# Altium project PCB_Project.PrjPcb (part 1 of 2)
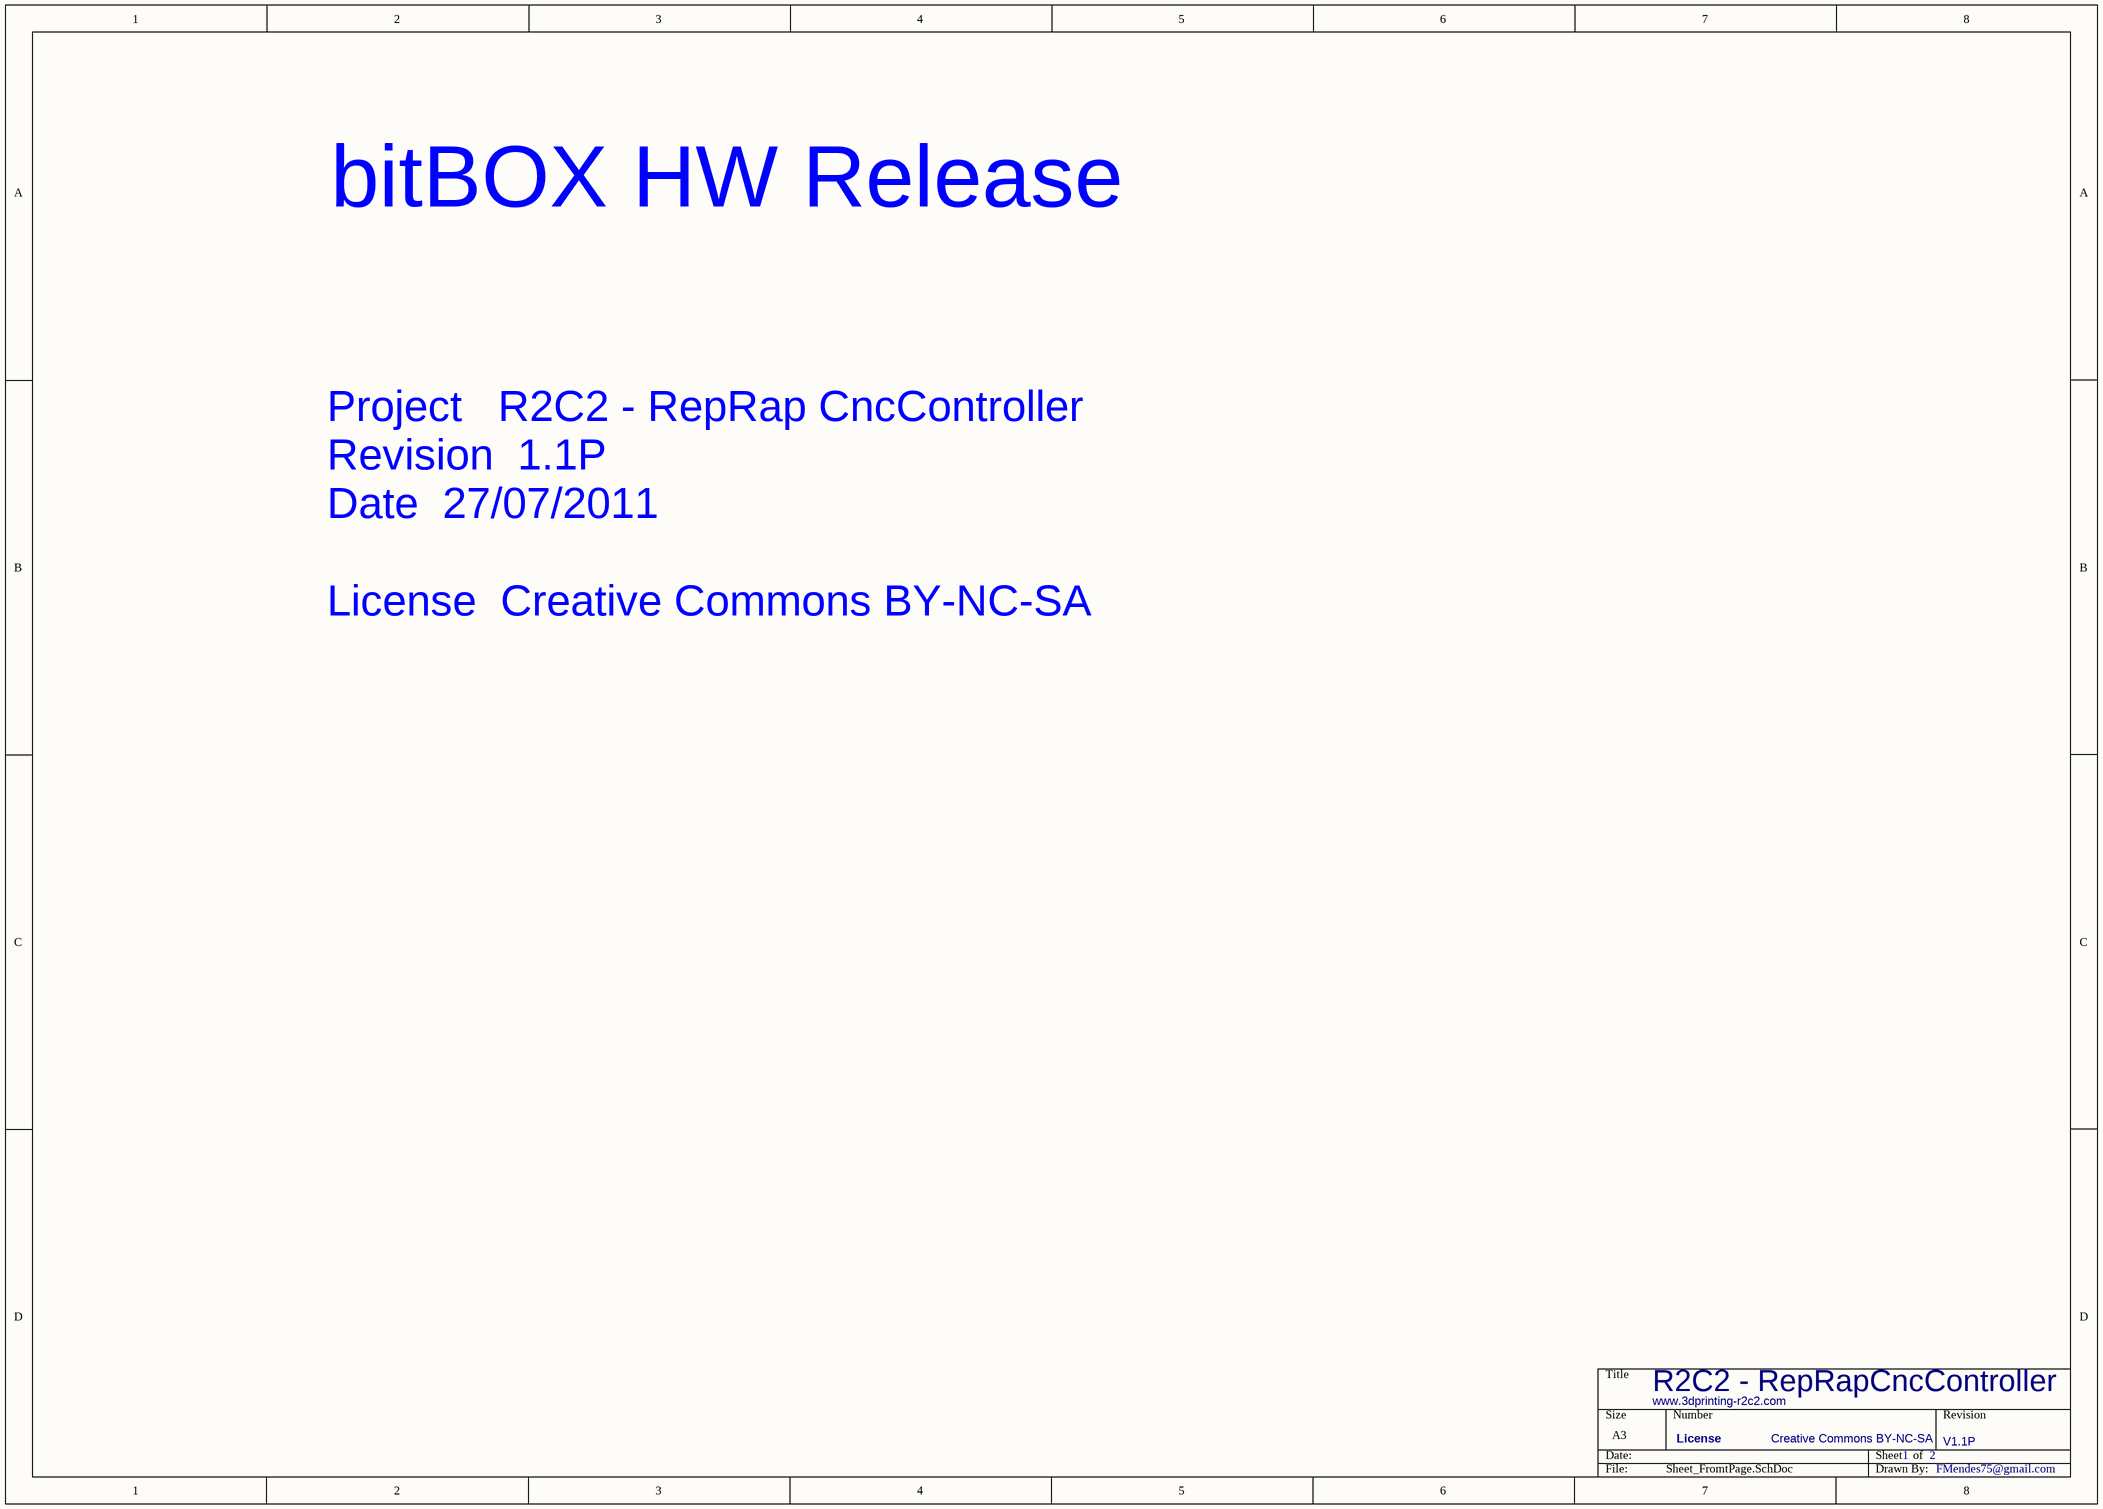
[diagram p0: Sheet_FromtPage.SchDoc]
3 sheets, 284 parts. Net scope: flat (ports and power ports of the same name join across sheets).
Board files: PCB7_optoswitch.PcbDoc, PCB7_main_board.PcbDoc
Sheets:
  Sheet_FromtPage.SchDoc
  Sheet_1.SchDoc
  Sheet_2.SchDoc

## Sheet Sheet_FromtPage.SchDoc: R2C2 - RepRapCncController
size A3; CompanyName: bitBOX; DrawnBy: FMendes75@gmail.com; Revision: V1.1P; SheetNumber: 1; SheetTotal: 2; PageSetup: Record=PageOptions|CenterHorizontal=True|CenterVertical=True|PrintScale=1.04|XCorrection=1.00|YCorrection=1.00|PrintKind=1|BorderSize=5000000|LeftOffset=0|BottomOffset=0|Orientation=2|PaperLength=1000|PaperWidth=1000|Scale=100|PaperSource=7|PrintQuality=-4|MediaType=1|DitherType=10|PaperKind=A3|PrintScaleMode=1; license: Creative Commons BY-NC-SA; Site: www.3dprinting-r2c2.com; ProjectName: R2C2 - RepRapCncController

### Notes on the sheet
- bitBOX HW Release
- Project 		R2C2 - RepRap CncController
  Revision		1.1P
  Date		27/07/2011
  License		Creative Commons BY-NC-SA
- License

## Sheet Sheet_1.SchDoc: R2C2 - RepRapCncController
size A3; CompanyName: bitBOX; DrawnBy: FMendes75@gmail.com; Revision: V1.1P; SheetNumber: 1; SheetTotal: 2; PageSetup: Record=PageOptions|CenterHorizontal=True|CenterVertical=True|PrintScale=1.04|XCorrection=1.00|YCorrection=1.00|PrintKind=1|BorderSize=5000000|LeftOffset=0|BottomOffset=0|Orientation=2|PaperLength=1000|PaperWidth=1000|Scale=100|PaperSource=7|PrintQuality=-4|MediaType=1|DitherType=10|PaperKind=A3|PrintScaleMode=1; license: Creative Commons BY-NC-SA; Site: www.3dprinting-r2c2.com; ProjectName: R2C2 - RepRapCncController
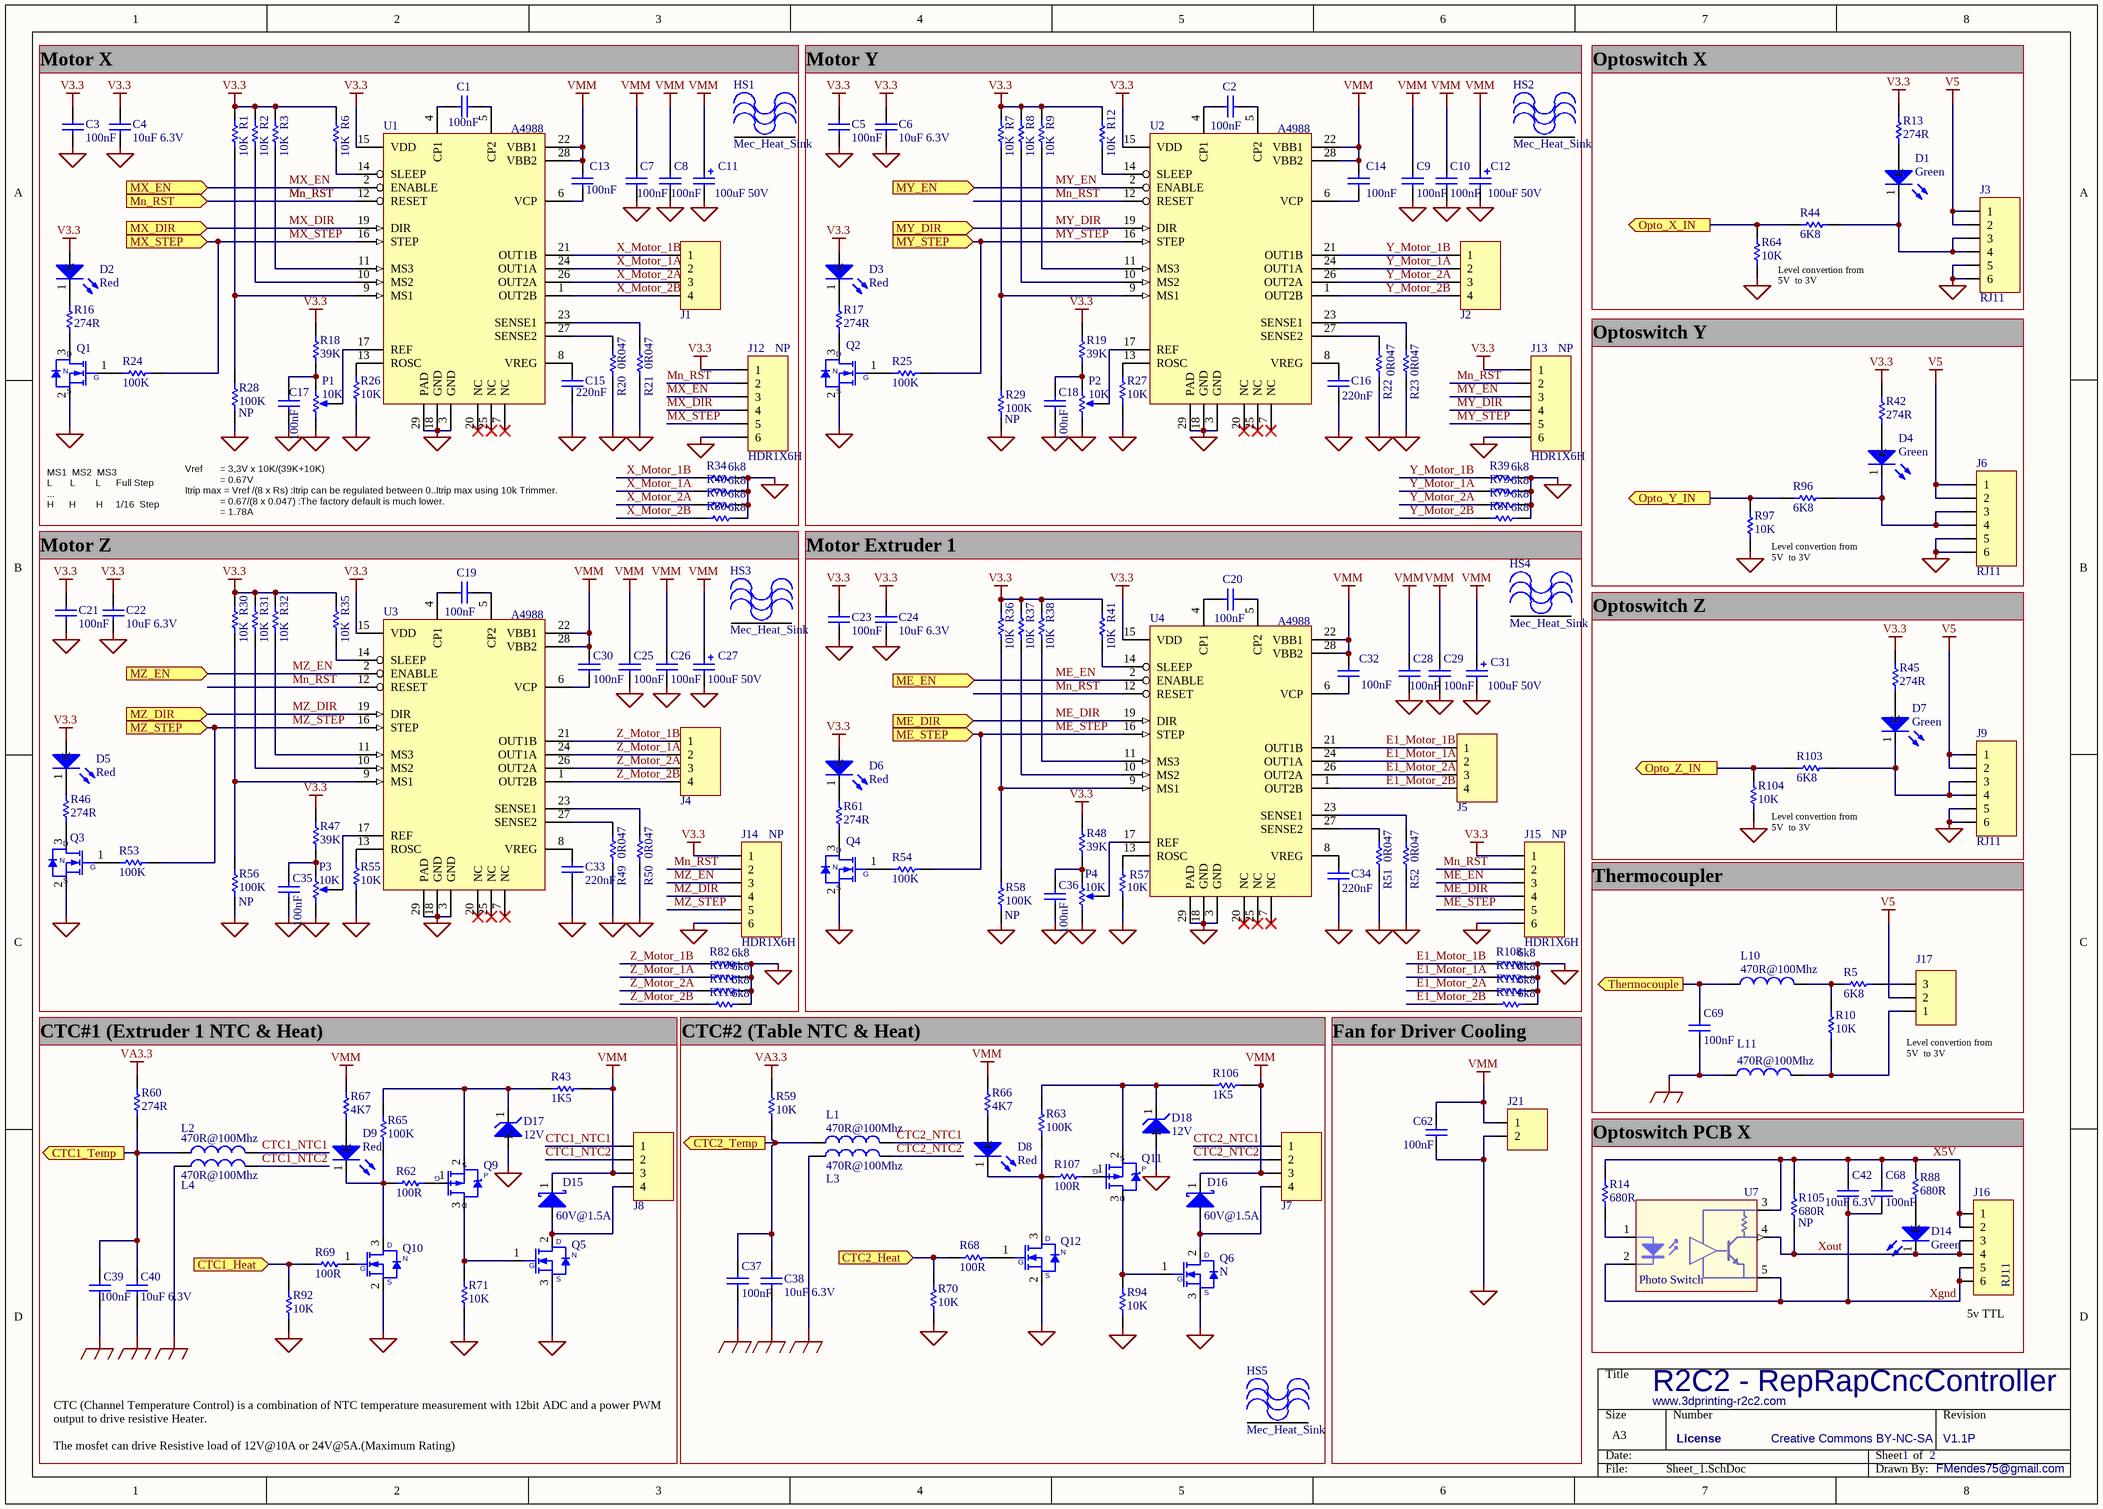
[diagram p1: Sheet_1.SchDoc]

### Parts
C1  100nF  [CAPC1608M]
C2  100nF  [CAPC1608M]
C3  100nF  [CAPC1608M]
C4  10uF 6.3V  [CAPC2012M]
C5  100nF  [CAPC1608M]
C6  10uF 6.3V  [CAPC2012M]
C7  100nF  [CAPC1608M]
C8  100nF  [CAPC1608M]
C9  100nF  [CAPC1608M]
C10  100nF  [CAPC1608M]
C11  100uF 50V  [CAPAE100X100M]
C12  100uF 50V  [CAPAE100X100M]
C13  100nF  [CAPC1608M]
C14  100nF  [CAPC1608M]
C15  220nF  [CAPC1608M]
C16  220nF  [CAPC1608M]
C17  100nF  [CAPC1608M]
C18  100nF  [CAPC1608M]
C19  100nF  [CAPC1608M]
C20  100nF  [CAPC1608M]
C21  100nF  [CAPC1608M]
C22  10uF 6.3V  [CAPC2012M]
C23  100nF  [CAPC1608M]
C24  10uF 6.3V  [CAPC2012M]
C25  100nF  [CAPC1608M]
C26  100nF  [CAPC1608M]
C27  100uF 50V  [CAPAE100X100M]
C28  100nF  [CAPC1608M]
C29  100nF  [CAPC1608M]
C30  100nF  [CAPC1608M]
C31  100uF 50V  [CAPAE100X100M]
C32  100nF  [CAPC1608M]
C33  220nF  [CAPC1608M]
C34  220nF  [CAPC1608M]
C35  100nF  [CAPC1608M]
C36  100nF  [CAPC1608M]
C37  100nF  [CAPC1608M]
C38  10uF 6.3V  [CAPC2012M]
C39  100nF  [CAPC1608M]
C40  10uF 6.3V  [CAPC2012M]
C42  10uF 6.3V  [CAPC2012M]
C62  100nF  [CAPC1608M]
C68  100nF  [CAPC1608M]
C69  100nF  [CAPC1608M]
D1  Green  [LEDM_3216X12M]
D2  Red  [LEDM_3216X12M]
D3  Red  [LEDM_3216X12M]
D4  Green  [LEDM_3216X12M]
D5  Red  [LEDM_3216X12M]
D6  Red  [LEDM_3216X12M]
D7  Green  [LEDM_3216X12M]
D8  Red  [LEDM_3216X12M]
D9  Red  [LEDM_3216X12M]
D14  Green  [LEDM_3216X12M]
D15  60V@1.5A  [SMA]
D16  60V@1.5A  [SMA]
D17  12V  [SOD323]
D18  12V  [SOD323]
HS1  Mec_Heat_Sink  [HS_180x130x50]
HS2  Mec_Heat_Sink  [HS_180x130x50]
HS3  Mec_Heat_Sink  [HS_180x130x50]
HS4  Mec_Heat_Sink  [HS_180x130x50]
HS5  Mec_Heat_Sink  [FK_244_13_D2PAK]
J1  Con 4  [WEIDMULLER_SL-5.08-04-90B]  (value not drawn)
J2  Con 4  [WEIDMULLER_SL-5.08-04-90B]  (value not drawn)
J3  RJ11  [MOLEX_95022-2667]
J4  Con 4  [WEIDMULLER_SL-5.08-04-90B]  (value not drawn)
J5  Con 4  [WEIDMULLER_SL-5.08-04-90B]  (value not drawn)
J6  RJ11  [MOLEX_95022-2667]
J7  Con 4  [WEIDMULLER_SL-5.08-04-90B]  (value not drawn)
J8  Con 4  [WEIDMULLER_SL-5.08-04-90B]  (value not drawn)
J9  RJ11  [MOLEX_95022-2667]
J12  HDR1X6H  Populate: NP  [HDR1X6]
J13  HDR1X6H  Populate: NP  [HDR1X6]
J14  HDR1X6H  Populate: NP  [HDR1X6]
J15  HDR1X6H  Populate: NP  [HDR1X6]
J16  RJ11  [MOLEX_95022-2667]
J17  Con 3  [phoenix-contact_smkdsn-5.08]  (value not drawn)
J21  Con 2  [MOLEX_22-29-2021]  (value not drawn)
L1  470R@100Mhz  [INDC1608M]
L2  470R@100Mhz  [INDC1608M]
L3  470R@100Mhz  [INDC1608M]
L4  470R@100Mhz  [INDC1608M]
L10  470R@100Mhz  [INDC1608M]
L11  470R@100Mhz  [INDC1608M]
P1  10K  [Trimmer_14]
P2  10K  [Trimmer_14]
P3  10K  [Trimmer_14]
P4  10K  [Trimmer_14]
Q1  N  [SOT323-3AM]
Q2  N  [SOT323-3AM]
Q3  N  [SOT323-3AM]
Q4  N  [SOT323-3AM]
Q5  N  [D2PAK]
Q6  N  [D2PAK]
Q9  P  [SOT23-3M]
Q10  N  [SOT323-3AM]
Q11  P  [SOT23-3M]
Q12  N  [SOT323-3AM]
R1  10K  [RESC1608M]
R2  10K  [RESC1608M]
R3  10K  [RESC1608M]
R5  6K8  [RESC1608M]
R6  10K  [RESC1608M]
R7  10K  [RESC1608M]
R8  10K  [RESC1608M]
R9  10K  [RESC1608M]
R10  10K  [RESC1608M]
R12  10K  [RESC1608M]
R13  274R  [RESC1608M]
R14  680R  [RESC1608M]
R16  274R  [RESC1608M]
R17  274R  [RESC1608M]
R18  39K  [RESC1608M]
R19  39K  [RESC1608M]
R20  0R047  [RESC3216M]
R21  0R047  [RESC3216M]
R22  0R047  [RESC3216M]
R23  0R047  [RESC3216M]
R24  100K  [RESC1608M]
R25  100K  [RESC1608M]
R26  10K  [RESC1608M]
R27  10K  [RESC1608M]
R28  100K  Populate: NP  [RESC1608M]
R29  100K  Populate: NP  [RESC1608M]
R30  10K  [RESC1608M]
R31  10K  [RESC1608M]
R32  10K  [RESC1608M]
R34  6k8  [RESC2012L]
R35  10K  [RESC1608M]
R36  10K  [RESC1608M]
R37  10K  [RESC1608M]
R38  10K  [RESC1608M]
R39  6k8  [RESC2012L]
R40  6k8  [RESC2012L]
R41  10K  [RESC1608M]
R42  274R  [RESC1608M]
R43  1K5  [RESC1608M]
R44  6K8  [RESC1608M]
R45  274R  [RESC1608M]
R46  274R  [RESC1608M]
R47  39K  [RESC1608M]
R48  39K  [RESC1608M]
R49  0R047  [RESC3216M]
R50  0R047  [RESC3216M]
R51  0R047  [RESC3216M]
R52  0R047  [RESC3216M]
R53  100K  [RESC1608M]
R54  100K  [RESC1608M]
R55  10K  [RESC1608M]
R56  100K  Populate: NP  [RESC1608M]
R57  10K  [RESC1608M]
R58  100K  Populate: NP  [RESC1608M]
R59  10K  [RESC1608M]
R60  274R  [RESC1608M]
R61  274R  [RESC1608M]
R62  100R  [RESC1608M]
R63  100K  [RESC1608M]
R64  10K  [RESC1608M]
R65  100K  [RESC1608M]
R66  4K7  [RESC1608M]
R67  4K7  [RESC1608M]
R68  100R  [RESC1608M]
R69  100R  [RESC1608M]
R70  10K  [RESC1608M]
R71  10K  [RESC1608M]
R73  6k8  [RESC2012L]
R78  6k8  [RESC2012L]
R79  6k8  [RESC2012L]
R80  6k8  [RESC2012L]
R81  6k8  [RESC2012L]
R82  6k8  [RESC2012L]
R88  680R  [RESC1608M]
R92  10K  [RESC1608M]
R94  10K  [RESC1608M]
R96  6K8  [RESC1608M]
R97  10K  [RESC1608M]
R103  6K8  [RESC1608M]
R104  10K  [RESC1608M]
R105  680R  Populate: NP  [RESC1608M]
R106  1K5  [RESC1608M]
R107  100R  [RESC1608M]
R108  6k8  [RESC2012L]
R109  6k8  [RESC2012L]
R110  6k8  [RESC2012L]
R111  6k8  [RESC2012L]
R112  6k8  [RESC2012L]
R113  6k8  [RESC2012L]
R114  6k8  [RESC2012L]
U1  A4988  [QFN50P500X500X100-28M]
U2  A4988  [QFN50P500X500X100-28M]
U3  A4988  [QFN50P500X500X100-28M]
U4  A4988  [QFN50P500X500X100-28M]
U7  Photo Switch  [OPIC_122x50x10]

### Ports
CTC1_Heat (in), CTC1_Temp (out), CTC2_Heat (in), CTC2_Temp (out), ME_DIR (in), ME_EN (in), ME_STEP (in), Mn_RST (in), MX_DIR (in), MX_EN (in), MX_STEP (in), MY_DIR (in), MY_EN (in), MY_STEP (in), MZ_DIR (in), MZ_EN (in), MZ_STEP (in), Opto_X_IN (out), Opto_Y_IN (out), Opto_Z_IN (out), Thermocouple (out)

### Nets
GND: C3.1 C4.1 C5.1 C6.1 C7.2 C8.1 C9.1 C10.1 C11.2 C12.2 C15.1 C16.1 C17.1 C18.2 C21.1 C22.1 C23.1 C24.1 C25.1 C26.1 C27.2 C28.1 C29.1 C31.2 C33.1 C34.1 C35.1 C36.1 C62.1 D17.2(A) D18.2(A) J3.5 J3.6 J6.5 J6.6 J9.5 J9.6 J12.6 J13.6 J14.6 J15.6 J21.2 P1.1(TOP) P2.1(TOP) P3.1(TOP) P4.1(TOP) Q1.2(S) Q2.2(S) Q3.2(S) Q4.2(S) Q5.3(S) Q6.3(S) Q10.2(S) Q12.2(S) R20.1 R21.1 R22.1 R23.1 R26.1 R27.1 R28.1 R29.1 R34.2 R39.2 R40.2 R49.1 R50.1 R51.1 R52.1 R55.1 R56.1 R57.1 R58.1 R64.1 R70.1 R71.1 R73.2 R78.2 R79.2 R80.2 R81.2 R82.2 R92.1 R94.1 R97.1 R104.1 R108.2 R109.2 R110.2 R111.2 R112.2 R113.2 R114.2 U1.3(GND) U1.18(GND) U1.29(PAD) U2.3(GND) U2.18(GND) U2.29(PAD) U3.3(GND) U3.18(GND) U3.29(PAD) U4.3(GND) U4.18(GND) U4.29(PAD)
GND_A: C37.1 C38.1 C39.1 C40.1 C69.1 L3.1 L4.1 L11.1
V3.3: C3.2 C4.2 C5.2 C6.2 C21.2 C22.2 C23.2 C24.2 D2.2(A) D3.2(A) D5.2(A) D6.2(A) J12.1 J13.1 J14.1 J15.1 R1.2 R2.2 R3.2 R6.2 R7.2 R8.2 R9.2 R12.2 R13.2 R18.2 R19.2 R30.2 R31.2 R32.2 R35.2 R36.2 R37.2 R38.2 R41.2 R42.2 R45.2 R47.2 R48.2 U1.15(VDD) U2.15(VDD) U3.15(VDD) U4.15(VDD)
V5: J3.1 J3.2 J6.1 J6.2 J9.1 J9.2 J17.2
VA3.3: R59.2 R60.2
VMM: C7.1 C8.2 C9.2 C10.2 C11.1 C12.1 C13.2 C14.2 C25.2 C26.2 C27.1 C28.2 C29.2 C30.2 C31.1 C32.2 C62.2 D15.1(K) D16.1(K) J7.3 J8.3 J21.1 R43.2 R66.2 R67.2 R106.2 U1.22(VBB1) U1.28(VBB2) U2.22(VBB1) U2.28(VBB2) U3.22(VBB1) U3.28(VBB2) U4.22(VBB1) U4.28(VBB2)
CTC1_NTC1: J8.1 L2.2
CTC1_NTC2: J8.2 L4.2
CTC2_NTC1: J7.1 L1.2
CTC2_NTC2: J7.2 L3.2
E1_Motor_1A: J5.2 R110.1 U4.24(OUT1A)
E1_Motor_1B: J5.1 R108.1 U4.21(OUT1B)
E1_Motor_2A: J5.3 R112.1 U4.26(OUT2A)
E1_Motor_2B: J5.4 R114.1 U4.1(OUT2B)
EXP_AD2_P0.25: C69.2 L10.1 ; port Thermocouple
ME_DIR: J15.4 U4.19(DIR) ; port ME_DIR
ME_EN: J15.3 U4.2(ENABLE) ; port ME_EN
ME_STEP: J15.5 R54.2 U4.16(STEP) ; port ME_STEP
Mn_RST: J12.2 J13.2 J14.2 J15.2 U1.12(RESET) U2.12(RESET) U3.12(RESET) U4.12(RESET) ; port Mn_RST
MX_DIR: J12.4 U1.19(DIR) ; port MX_DIR
MX_EN: J12.3 U1.2(ENABLE) ; port MX_EN
MX_STEP: J12.5 R24.2 U1.16(STEP) ; port MX_STEP
MY_DIR: J13.4 U2.19(DIR) ; port MY_DIR
MY_EN: J13.3 U2.2(ENABLE) ; port MY_EN
MY_STEP: J13.5 R25.2 U2.16(STEP) ; port MY_STEP
MZ_DIR: J14.4 U3.19(DIR) ; port MZ_DIR
MZ_EN: J14.3 U3.2(ENABLE) ; port MZ_EN
MZ_STEP: J14.5 R53.2 U3.16(STEP) ; port MZ_STEP
X5V: C42.2 C68.2 J16.1 J16.2 R14.2 R88.2 R105.2 U7.3(Vcc)
X_Motor_1A: J1.2 R40.1 U1.24(OUT1A)
X_Motor_1B: J1.1 R34.1 U1.21(OUT1B)
X_Motor_2A: J1.3 R78.1 U1.26(OUT2A)
X_Motor_2B: J1.4 R80.1 U1.1(OUT2B)
Xgnd: C42.1 C68.1 J16.5 J16.6 U7.2(K) U7.5(GND)
Xout: D14.1(K) J16.3 J16.4 R105.1 U7.4(Out)
Y_Motor_1A: J2.2 R73.1 U2.24(OUT1A)
Y_Motor_1B: J2.1 R39.1 U2.21(OUT1B)
Y_Motor_2A: J2.3 R79.1 U2.26(OUT2A)
Y_Motor_2B: J2.4 R81.1 U2.1(OUT2B)
Z_Motor_1A: J4.2 R109.1 U3.24(OUT1A)
Z_Motor_1B: J4.1 R82.1 U3.21(OUT1B)
Z_Motor_2A: J4.3 R111.1 U3.26(OUT2A)
Z_Motor_2B: J4.4 R113.1 U3.1(OUT2B)
NetC1_1: C1.1 U1.5(CP2)
NetC1_2: C1.2 U1.4(CP1)
NetC2_1: C2.1 U2.4(CP1)
NetC2_2: C2.2 U2.5(CP2)
NetC13_1: C13.1 U1.6(VCP)
NetC14_1: C14.1 U2.6(VCP)
NetC15_2: C15.2 U1.8(VREG)
NetC16_2: C16.2 U2.8(VREG)
NetC17_2: C17.2 P1.2(BOT) R18.1
NetC18_1: C18.1 P2.2(BOT) R19.1
NetC19_1: C19.1 U3.5(CP2)
NetC19_2: C19.2 U3.4(CP1)
NetC20_1: C20.1 U4.4(CP1)
NetC20_2: C20.2 U4.5(CP2)
NetC30_1: C30.1 U3.6(VCP)
NetC32_1: C32.1 U4.6(VCP)
NetC33_2: C33.2 U3.8(VREG)
NetC34_2: C34.2 U4.8(VREG)
NetC35_2: C35.2 P3.2(BOT) R47.1
NetC36_2: C36.2 P4.2(BOT) R48.1
NetC37_2: C37.2 C38.2 L1.1 R59.1 ; port CTC2_Temp
NetC39_2: C39.2 C40.2 L2.1 R60.1 ; port CTC1_Temp
NetD1_1: D1.1(K) J3.3 J3.4 R44.1
NetD1_2: D1.2(A) R13.1
NetD2_1: D2.1(K) R16.2
NetD3_1: D3.1(K) R17.2
NetD4_1: D4.1(K) J6.3 J6.4 R96.1
NetD4_2: D4.2(A) R42.1
NetD5_1: D5.1(K) R46.2
NetD6_1: D6.1(K) R61.2
NetD7_1: D7.1(K) J9.3 J9.4 R103.1
NetD7_2: D7.2(A) R45.1
NetD8_1: D8.1(K) Q12.3(D) R63.1 R107.1
NetD8_2: D8.2(A) R66.1
NetD9_1: D9.1(K) Q10.3(D) R62.1 R65.1
NetD9_2: D9.2(A) R67.1
NetD14_2: D14.2(A) R88.1
NetD15_2: D15.2(A) J8.4 Q5.2(D)
NetD16_2: D16.2(A) J7.4 Q6.2(D)
NetD17_1: D17.1(K) Q9.2(S) R43.1 R65.2
NetD18_1: D18.1(K) Q11.2(S) R63.2 R106.1
NetJ17_1: J17.1 L11.2 R10.2
NetJ17_3: J17.3 R5.2
NetL10_2: L10.2 R5.1 R10.1
NetP1_3: P1.3(TAP) U1.17(REF)
NetP2_3: P2.3(TAP) U2.17(REF)
NetP3_3: P3.3(TAP) U3.17(REF)
NetP4_3: P4.3(TAP) U4.17(REF)
NetQ1_1: Q1.1(G) R24.1
NetQ1_3: Q1.3(D) R16.1
NetQ2_1: Q2.1(G) R25.1
NetQ2_3: Q2.3(D) R17.1
NetQ3_1: Q3.1(G) R53.1
NetQ3_3: Q3.3(D) R46.1
NetQ4_1: Q4.1(G) R54.1
NetQ4_3: Q4.3(D) R61.1
NetQ5_1: Q5.1(G) Q9.3(D) R71.2
NetQ6_1: Q6.1(G) Q11.3(D) R94.2
NetQ9_1: Q9.1(G) R62.2
NetQ10_1: Q10.1(G) R69.2
NetQ11_1: Q11.1(G) R107.2
NetQ12_1: Q12.1(G) R68.2
NetR1_1: R1.1 R28.2 U1.9(MS1)
NetR2_1: R2.1 U1.10(MS2)
NetR3_1: R3.1 U1.11(MS3)
NetR6_1: R6.1 U1.14(SLEEP)
NetR7_1: R7.1 R29.2 U2.9(MS1)
NetR8_1: R8.1 U2.10(MS2)
NetR9_1: R9.1 U2.11(MS3)
NetR12_1: R12.1 U2.14(SLEEP)
NetR14_1: R14.1 U7.1(A)
NetR20_2: R20.2 U1.27(SENSE2)
NetR21_2: R21.2 U1.23(SENSE1)
NetR22_2: R22.2 U2.27(SENSE2)
NetR23_2: R23.2 U2.23(SENSE1)
NetR26_2: R26.2 U1.13(ROSC)
NetR27_2: R27.2 U2.13(ROSC)
NetR30_1: R30.1 R56.2 U3.9(MS1)
NetR31_1: R31.1 U3.10(MS2)
NetR32_1: R32.1 U3.11(MS3)
NetR35_1: R35.1 U3.14(SLEEP)
NetR36_1: R36.1 R58.2 U4.9(MS1)
NetR37_1: R37.1 U4.10(MS2)
NetR38_1: R38.1 U4.11(MS3)
NetR41_1: R41.1 U4.14(SLEEP)
NetR44_2: R44.2 R64.2 ; port Opto_X_IN
NetR49_2: R49.2 U3.27(SENSE2)
NetR50_2: R50.2 U3.23(SENSE1)
NetR51_2: R51.2 U4.27(SENSE2)
NetR52_2: R52.2 U4.23(SENSE1)
NetR55_2: R55.2 U3.13(ROSC)
NetR57_2: R57.2 U4.13(ROSC)
NetR68_1: R68.1 R70.2 ; port CTC2_Heat
NetR69_1: R69.1 R92.2 ; port CTC1_Heat
NetR96_2: R96.2 R97.2 ; port Opto_Y_IN
NetR103_2: R103.2 R104.2 ; port Opto_Z_IN

Not connected (* = marked no-connect by the designer): U1 7(NC)* 20(NC)* 25(NC)*; U2 7(NC)* 20(NC)* 25(NC)*; U3 7(NC)* 20(NC)* 25(NC)*; U4 7(NC)* 20(NC)* 25(NC)*

### Notes on the sheet
- Motor X
- Motor Y
- Optoswitch X
- (near R64) Level convertion from 5V  to 3V
- Optoswitch Y
- MS1  MS2  MS3
  L       L        L      Full Step
  ...
  H      H        H     1/16  Step
- Vref       = 3,3V x 10K/(39K+10K)
  = 0.67V
  Itrip max = Vref /(8 x Rs)	:Itrip can be regulated between 0..Itrip max using 10k Trimmer.
  = 0.67/(8 x 0.047)	:The factory default is much lower.
  = 1.78A
- (near R80) Motor Z
- Motor Extruder 1
- (near R97) Level convertion from 5V  to 3V
- Optoswitch Z
- (near R104) Level convertion from 5V  to 3V
- Thermocoupler
- CTC#1 (Extruder 1 NTC & Heat)
- (near R113) CTC#2 (Table NTC & Heat)
- (near R114) Fan for Driver Cooling
- (near J17) Level convertion from 5V  to 3V
- Optoswitch PCB X
- (near J16) 5v TTL
- CTC (Channel Temperature Control) is a combination of NTC temperature measurement with 12bit ADC and a power PWM output to drive resistive Heater.
  The mosfet can drive Resistive load of 12V@10A or 24V@5A.(Maximum Rating)
- License

### Library data of the parts
C1 C3 C5 C7-C10 C13 C14 C17-C19 C21 C23 C25 C26 C28-C30 C32 C35-C37 C39 C62 C68 C69 = 10000054: Capacitor - MLCC; 0603; NP0; 50V; Manufacturer: Multicomp; Type: smd; Designator: C; Man PN: MCCA000255; Pack: 0603; Distri Price1: 0,008; Distri Qty1: 100; Part Number: 10000054; Value: 100nF; Pin Count: 2; Distri Link1: http://pt.farnell.com/multicomp/mcca000255/mlcc-0603-x7r-50v-100nf/dp/1759122; Component Type: Standard
C2 C20 = 10000054: Capacitor Non Polarized; Manufacturer: Multicomp; Type: smd; Designator: C; Man PN: MCCA000255; Description: Capacitor - MLCC; 0603; NP0; 50V; Pack: 0603; Distri Price1: 0,008; Distri Qty1: 100; Part Number: 10000054; Component Type: Standard; Value: 100nF; Pin Count: 2; Distri Link1: http://pt.farnell.com/multicomp/mcca000255/mlcc-0603-x7r-50v-100nf/dp/1759122
C4 C6 C22 C24 C38 C40 C42 = 10000001: Capacitor - MLCC; 0805; Y5V; 10UF; 6.3V; Manufacturer: MULTICOMP; Type: smd; Designator: C; Man PN: MCCA000268; Pack: 0805; Distri Price1: 0,039; Distri Qty1: 100; Part Number: 10000001; Verified: 17-01-2011; Value: 10uF 6.3V; Pin Count: 2; Distri Link1: http://pt.farnell.com/multicomp/mcca000268/mlcc-08055v-6-3v-10uf/dp/1759136; Stock: 0; Component Type: Standard
C11 C12 C27 C31 = 10000069: Capacitor - Al. Electrolytic; 100UF; 50V; Manufacturer: Vishay; Type: smd; Designator: C; Man PN: 222215097101; Distri Price1: 0,71; Distri Qty1: 100; Part Number: 10000069; Value: 100uF 50V; Pin Count: 2; Distri Link1: http://pt.farnell.com/vishay-bc-components/222215097101/cap-alum-elect-100uf-50v-smd/dp/1838778; Component Type: Standard
C15 C16 C33 C34 = 10000059: Capacitor - MLCC; 0603; NP0; 50V; Manufacturer: Multicomp; Type: smd; Designator: C; Pack: 0603; Distri Price1: 0,08; Distri Qty1: 100; Distri Price2: 0,018; Part Number: 10000059; Value: 220nF; Pin Count: 2; Distri Link1: http://pt.farnell.com/multicomp/mcca000196/mlcc-0603-np0-50v-22pf/dp/1759057; Distri Link2: http://search.digikey.com/scripts/DkSearch/dksus.dll?Detail&name=709-1156-1-ND; Distri Qty2: 100; Component Type: Standard
D1 D4 D7 D14 = 10000008: Led - 1206; Green OSRAM; Type: smd; Designator: D; Man PN: LGQ971; Pack: 1206; Distri Price1: 0,063; Distri Qty1: 100; Part Number: 10000008; Manufacturer: OSRAM; Value: Green; Pin Count: 2; Distri Link1: http://pt.farnell.com/osram/lgq971/led-smd-green/dp/1226372; Stock: 0; Component Type: Standard
D2 D3 D5 D6 D8 D9 = 10000089: Led - 1206; Red; Type: smd; Designator: D; Pack: 1206; Distri Price1: 0; Distri Qty1: 100; Part Number: 10000089; Man PN: -; Manufacturer: -; Value: Red; Pin Count: 2; Distri Link1: -; Distri Link2: -; Distri Price2: 0; Distri Qty2: 100; Stock: 0; ComponentLink1URL: -; ComponentLink2Description: -; ComponentLink2URL: -; Signal Integrity: -; Simulation: -; Component Type: Standard; Verified: 05-05-2011
D15 D16 = 10000010: Diode - Schottky; 1.5A; 60V; Manufacturer: VISHAY; Type: smd; Designator: D; Man PN: VS-10MQ060NTRPBF; Distri Price1: 0,092; Distri Qty1: 100; Part Number: 10000010; Value: 60V@1.5A; Pack: SMA; Pin Count: 2; Distri Link1: http://pt.farnell.com/vishay-formerly-i-r/vs-10mq060ntrpbf/diode-schottky-1-5a-60v/dp/1463213; Stock: 0; Component Type: Standard
D17 D18 = 10000088: Diode - Zener; 0.4W; 12V; Manufacturer: NXP; Type: smd; Designator: D; Man PN: PDZ12B; Pack: SC-76; Distri Qty1: 100; Part Number: 10000088; Value: 12V; Pin Count: 2; Distri Link1: http://pt.farnell.com/nxp/pdz12b-115/diode-zener-0-4w-12v-sod323/dp/1757850; Component Type: Standard
HS1-HS4 = 10000090: Heat Sink - IC stiker; Designator: HS; Distri Qty1: 0; Part Number: 10000090; Type: smd; Man PN: -; Manufacturer: -; Value: -; Pack: -; Pin Count: 0; Component Type: Standard
HS5 = 10000091: Heat Sink - For D2PAK; Manufacturer: Fischer Elektronik; Designator: HS; Man PN: FK-244-13 D2 PAK; Distri Price1: 0,82; Distri Qty1: 25; Part Number: 10000091; Type: smd; Value: -; Pack: -; Pin Count: 2; Distri Link1: http://pt.farnell.com/fischer-elektronik/fk-244-13-d2-pak/heat-sink-for-d2-pak-22-8-c-w/dp/4302436; Distri Link2: -; Distri Price2: -; Distri Qty2: -; Stock: 0; ComponentLink1Description: -; ComponentLink1URL: -; ComponentLink2Description: -; ComponentLink2URL: -; Signal Integrity: -; Simulation: -; Component Type: Standard; Verified: 09-05-2011
J1 J2 J4 J5 J7 J8 = 10000023: Connector - Header male; Screw; 4way; Hor.; Manufacturer: WEIDMULLER; Designator: J; Man PN: SL 5.08/4/90B; Distri Price1: 0,5; Distri Qty1: 100; Distri Price2: 0,173; Part Number: 10000023; Type: THD; Pin Count: 4; Distri Link1: http://pt.farnell.com/jsp/search/productdetail.jsp?sku=1121838; Distri Link2: http://search.digikey.com/scripts/DkSearch/dksus.dll?Detail&name=ED2830-ND; Distri Qty2: 100; Stock: 0; Component Type: Standard
J3 J6 J9 J16 = 10000062: Connector - PCB; RJ11; 6/4 Low Profile; Hor.; Manufacturer: Molex; Designator: J; Man PN: 95501-2641; Distri Qty1: 100; Distri Price1: 0,51; Distri Price2: 0,479; Part Number: 10000062; Type: THD; Value: RJ11; Pin Count: 6; Distri Link1: http://pt.farnell.com/molex/95501-2641/jack-6-4-low-profile/dp/1560166; Component Type: Standard; Distri Link2: http://search.digikey.com/scripts/DkSearch/dksus.dll?Detail&name=380-1018-ND; Distri Qty2: 100
J12-J15 = 10000093: Designator: J; Description: Connector - Header 1x6; Vert..; Distri Price1: 0; Part Number: 10000093; Component Type: Standard; Type: THD; Man PN: -; Manufacturer: -; Value: HDR1X6H; Pack: -; Pin Count: 6; Distri Link1: -; Distri Qty1: 0; Distri Link2: -; Distri Price2: -; Distri Qty2: -; Stock: 0; ComponentLink1Description: -; ComponentLink1URL: -; ComponentLink2Description: -; ComponentLink2URL: -; Signal Integrity: -; Simulation: -
J17 = 10000095: Manufacturer: Phoenix_Contact; Designator: J; Man PN: SMKDSN1.5/3-5.08; Description: Terminal Block; Distri Price1: 76; Distri Qty1: 100; Part Number: 10000095; Component Type: Standard; Type: smd; Value: -; Pack: -; Pin Count: 3; Distri Link1: http://pt.farnell.com/phoenix-contact/smkdsn1-5-3-5-08/term-blk-pcb-55deg-5-08mm-3way/dp/1792904; Distri Link2: -; Distri Price2: -; Distri Qty2: -; Stock: 0; ComponentLink1Description: -; ComponentLink1URL: -; ComponentLink2Description: -; ComponentLink2URL: -; Signal Integrity: -; Simulation: -; Verified: 17-05-2011
J21 = 10000097: Connector - PCB; Header; SQ Pin, 2 way; 2.54mm; Vert; Manufacturer: Molex; Designator: J; Distri Qty1: 0; Part Number: 10000097; Component Type: Standard; Type: smd; Man PN: 22-29-2021; Value: -; Pack: -; Pin Count: 2; Distri Link1: http://pt.farnell.com/molex/22-29-2021/header-vertical-sq-pin-0-1-2way/dp/1360130; Distri Price2: 0
L1-L4 L10 L11 = 10000032: Ferrite Bead - 470OHM; 0603; Manufacturer: MURATA; Type: smd; Designator: L; Man PN: BLM18PG471SN1D; Pack: 0603; Distri Price1: 0,034; Distri Qty1: 100; Part Number: 10000032; Value: 470R@100Mhz; Pin Count: 2; Stock: 0; Component Type: Standard
P1-P4 = 10000092: Resistor - Trimmer; 1/4"; 10K; Manufacturer: Bourns; Designator: R; Man PN: 3362P-1-103LF; Distri Price1: 0; Part Number: 10000092; Type: THD; Value: 10K; Pack: -; Pin Count: 3; Distri Link1: -; Distri Qty1: 0
Q1-Q4 Q10 Q12 = 10000039: Mosfet - N; 60V; 0.3A;; Manufacturer: NXP; Type: smd; Designator: Q; Man PN: 2N7002PW; Pack: SOT323; Distri Price1: 0,025; Distri Qty1: 100; Part Number: 10000039; Distri Link1: http://pt.farnell.com/nxp/2n7002pw/mosfet-n-ch-60v-0-3a-sot323/dp/1829184; Stock: 0; Component Type: Standard
Q5 Q6 = 10000078: N-channel Enhancement Mode Field-effect Transistor (123/gds); Manufacturer: IR; Type: smd; Designator: Q; Man PN: IRFS3806PbF; Value: 60V; 43A; Description: Mosfet - Power High Efficiency for SMPS; Distri Price1: 0,45; Distri Qty1: 100; Part Number: 10000078; Component Type: Standard; Pack: D2PAK; Pin Count: 3; Distri Link1: http://pt.farnell.com/international-rectifier/irfs3806pbf/mosfet-n-d2-pak/dp/1602233; Distri Link2: -; Distri Price2: -; Distri Qty2: -; Stock: 0; ComponentLink1URL: -; ComponentLink2Description: -; ComponentLink2URL: -; Signal Integrity: -; Simulation: -; Verified: 03-03-2011
Q9 Q11 = 10000076: Mosfet - Power; Vdss=-30v; Rds=0.60; Id=-0.6A; Manufacturer: IR; Type: smd; Designator: Q; Man PN: IRLML5103; Value: 0.6A; Pack: Sot-23; Distri Price1: 0,128; Distri Qty1: 100; Part Number: 10000076; Component Type: Standard; Pin Count: 3; Distri Link1: http://pt.farnell.com/international-rectifier/irlml5103trpbf/mosfet-p-micro3/dp/1463265; Distri Link2: -; Distri Price2: -; Distri Qty2: -; Stock: 0; ComponentLink1URL: -; ComponentLink2Description: -; ComponentLink2URL: -; Signal Integrity: -; Simulation: -
R1-R3 R6-R9 R12 R26 R27 R30-R32 R35-R38 R41 R55 R57 R64 R70 R71 R92 R94 R97 R104 = 10000044: Resistor - 0603; 0.063W; 1%; Manufacturer: Multicomp; Designator: R; Man PN: MC 0.063W 0603 1% 10K; Pack: 0603; Distri Qty1: 0; Part Number: 10000044; Type: smd; Value: 10K; Pin Count: 2; Component Type: Standard
R5 R44 R96 R103 = 10000096: Resistor - 0603; 0.063W; 1%; Designator: R; Distri Qty1: 0; Part Number: 10000096; Component Type: Standard; Type: smd; Man PN: -; Manufacturer: -; Value: 6K8; Pack: -; Pin Count: 2; Distri Link1: -
R10 R59 = 10000044: Resistor; Manufacturer: Multicomp; Designator: R; Man PN: MC 0.063W 0603 1% 10K; Description: Resistor - 0603; 0.063W; 1%; Pack: 0603; Distri Qty1: 0; Part Number: 10000044; Component Type: Standard; Type: smd; Value: 10K; Pin Count: 2
R13 R16 R17 R42 R45 R46 R61 = 10000041: Resistor - 0603; 0.063W; 1%; Manufacturer: Multicomp; Designator: R; Man PN: MC 0.063W 0603 1% 274R; Pack: 0603; Distri Price1: 0,008; Distri Qty1: 250; Part Number: 10000041; Type: smd; Value: 274R; Pin Count: 2; Distri Link1: http://pt.farnell.com/multicomp/mc-0-063w-0603-1-274r/resistor-0603-274r/dp/1170730; Stock: 0; Component Type: Standard
R14 R88 R105 = 10000061: Resistor - 0603; 0.063W; 1%; Manufacturer: Multicomp; Designator: R; Man PN: MC 0.063W 0603 1% 680R; Pack: 0603; Distri Price1: 0,016; Distri Qty1: 100; Distri Price2: 0,006; Part Number: 10000061; Type: smd; Value: 680R; Pin Count: 2; Distri Link1: http://pt.farnell.com/multicomp/mc-0-063w-0603-5-680r/resistor-0603-680r/dp/9332251; Distri Link2: http://pt.farnell.com/multicomp/mc-0-063w-0603-5-680r/resistor-0603-680r/dp/9332251; Distri Qty2: 100; Component Type: Standard
R18 R19 R47 R48 = 10000087: Resistor - 0603; 0.063W; 1%; Designator: R; Pack: 0603; Distri Qty1: 100; Part Number: 10000087; Type: smd; Man PN: -; Manufacturer: -; Value: 39K; Pin Count: 2; Distri Link1: -; Component Type: Standard
R20-R23 R49-R52 = 10000047: Resistor - 1206; 0.5W; 1%; Manufacturer: YAGEO; Designator: R; Man PN: RL1206FR-7W0R047L; Pack: 1206; Distri Price1: 0,26; Distri Qty1: 100; Part Number: 10000047; Type: smd; Value: 0R047; Pin Count: 2; Distri Link1: http://pt.farnell.com/yageo-phycomp/rl1206fr-7w0r047l/resistor-1206-1-0-047r/dp/8067562; Component Type: Standard
R24 R25 R28 R29 R53 R54 R56 R58 R63 R65 = 10000045: Resistor - 0603; 0.063W; 1%; Manufacturer: Multicomp; Designator: R; Man PN: MC 0.063W 0603 1% 100K; Pack: 0603; Distri Qty1: 0; Part Number: 10000045; Type: smd; Value: 100K; Pin Count: 2; Component Type: Standard
R34 R39 R40 R73 R78-R82 R108-R114 = 10000098: Resistor - 0805; 0.100W; 5%; Designator: R; Distri Qty1: 0; Part Number: 10000098; Component Type: Standard; Type: smd; Man PN: -; Manufacturer: -; Value: 6k8; Pack: -; Pin Count: 2; Distri Link1: -
R43 R106 = 10000048: Resistor - 0603; 0.063W; 1%; Manufacturer: Multicomp; Designator: R; Man PN: MC 0.063W 0603 1% 1K5; Pack: 0603; Distri Qty1: 0; Part Number: 10000048; Type: smd; Value: 1K5; Pin Count: 2; Component Type: Standard
R60 = 10000041: Resistor; Manufacturer: Multicomp; Designator: R; Man PN: MC 0.063W 0603 1% 274R; Description: Resistor - 0603; 0.063W; 1%; Pack: 0603; Distri Price1: 0,008; Distri Qty1: 250; Part Number: 10000041; Component Type: Standard; Type: smd; Value: 274R; Pin Count: 2; Distri Link1: http://pt.farnell.com/multicomp/mc-0-063w-0603-1-274r/resistor-0603-274r/dp/1170730; Stock: 0
R62 R68 R69 R107 = 10000042: Resistor - 0603; 0.063W; 1%; Manufacturer: Multicomp; Designator: R; Man PN: MC 0.063W 0603 1% 100R; Pack: 0603; Distri Price1: 0,006; Distri Qty1: 250; Part Number: 10000042; Type: smd; Value: 100R; Pin Count: 2; Distri Link1: http://pt.farnell.com/multicomp/mc-0-063w-0603-1-100r/resistor-0603-100r-0-063w-1/dp/9330364; Stock: 0; Component Type: Standard
R66 R67 = 10000050: Resistor - 0603; 0.063W; 1%; Manufacturer: Multicomp; Designator: R; Man PN: MC 0.063W 0603 1% 4K7; Pack: 0603; Distri Qty1: 0; Part Number: 10000050; Type: smd; Value: 4K7; Pin Count: 2; Component Type: Standard
U1-U4 = 10000094: A4988 (A4983 pinout compatible); Manufacturer: Allegro; Designator: IC; Man PN: A4988SETTR-T; Description: IC - stepper motor driver; Pack: QFN28; Distri Qty1: 0; Part Number: 10000094; Component Type: Standard; Type: smd; Value: -; Pin Count: 28; Distri Link1: -
U7 = 10000075: Opto - Switch; OPIC Sharp; Slotted 3mm; Vcc 5v; Designator: U; Man PN: GP1A53HRJ00F; Distri Price1: 1,94; Distri Qty1: 1; Part Number: 10000075; Type: THD; Manufacturer: Sharp; Value: -; Pack: -; Pin Count: 5; Distri Link1: http://pt.farnell.com/sharp/gp1a53hrj00f/photointerrupter/dp/9708006; Distri Link2: -; Distri Price2: -; Distri Qty2: -; Stock: 0; Component Type: Standard